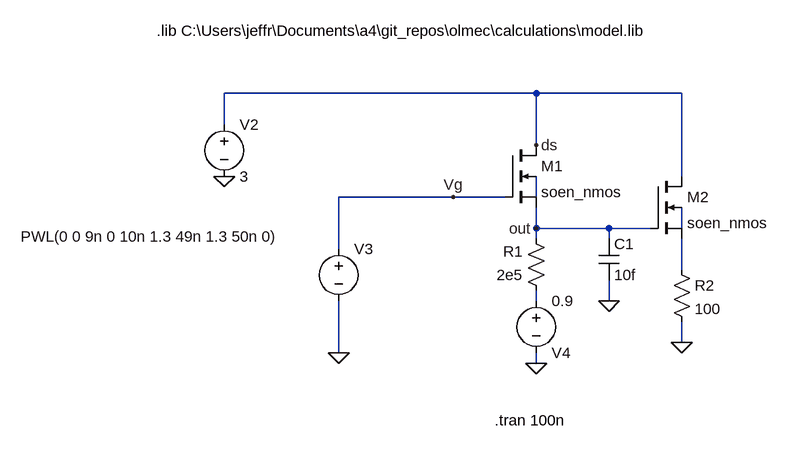
[diagram p0: schematic mosfet_rc_2mos.asc]
mosfet_rc_2mos.asc, the LTspice schematic file:
Version 4
SHEET 1 880 680
WIRE -272 144 -752 144
WIRE -48 144 -272 144
WIRE -752 192 -752 144
WIRE -272 224 -272 144
WIRE -48 272 -48 144
WIRE -400 304 -576 304
WIRE -320 304 -400 304
WIRE -272 304 -272 272
WIRE -272 352 -272 320
WIRE -160 352 -272 352
WIRE -96 352 -160 352
WIRE -48 352 -48 320
WIRE -272 368 -272 352
WIRE -160 368 -160 352
WIRE -576 384 -576 304
WIRE -48 416 -48 368
WIRE -272 464 -272 448
WIRE -160 464 -160 432
WIRE -48 528 -48 496
WIRE -576 544 -576 464
WIRE -272 560 -272 544
FLAG -752 272 0
FLAG -576 544 0
FLAG -272 224 ds
FLAG -400 304 Vg
FLAG -160 464 0
FLAG -272 352 out
FLAG -48 528 0
FLAG -272 560 0
SYMBOL voltage -752 176 R0
WINDOW 123 0 0 Left 0
WINDOW 39 0 0 Left 0
SYMATTR InstName V2
SYMATTR Value 3
SYMBOL voltage -576 368 R0
WINDOW 123 0 0 Left 0
WINDOW 39 0 0 Left 0
WINDOW 3 -489 -3 Left 2
SYMATTR Value PWL(0 0 9n 0 10n 1.3 49n 1.3 50n 0)
SYMATTR InstName V3
SYMBOL nmos4 -320 224 R0
SYMATTR InstName M1
SYMATTR Value soen_nmos
SYMATTR Value2 l=1u w=15u
SYMBOL res -256 464 R180
WINDOW 0 36 76 Left 2
WINDOW 3 36 40 Left 2
SYMATTR InstName R1
SYMATTR Value 2e5
SYMBOL nmos4 -96 272 R0
SYMATTR InstName M2
SYMATTR Value soen_nmos
SYMATTR Value2 l=1u w=10u
SYMBOL cap -176 368 R0
SYMATTR InstName C1
SYMATTR Value 10f
SYMBOL voltage -272 448 R0
WINDOW 0 24 96 Left 2
WINDOW 3 24 16 Left 2
WINDOW 123 0 0 Left 0
WINDOW 39 0 0 Left 0
SYMATTR InstName V4
SYMATTR Value 0.9
SYMBOL res -64 400 R0
SYMATTR InstName R2
SYMATTR Value 100
TEXT -336 648 Left 2 !.tran 100n
TEXT -856 48 Left 2 !.lib C:\\Users\\jeffr\\Documents\\a4\\git_repos\\olmec\\calculations\\model.lib

The netlist it stands for:
* mosfet_rc_2mos.asc
V2 ds 0 3
V3 Vg 0 PWL(0 0 9n 0 10n 1.3 49n 1.3 50n 0)
M1 ds Vg out N001 soen_nmos l=1u w=15u
R1 N004 out 2e5
M2 ds out N003 N002 soen_nmos l=1u w=10u
C1 out 0 10f
V4 N004 0 0.9
R2 N003 0 100
.model NMOS NMOS
.model PMOS PMOS
.lib standard.mos
.tran 100n
.lib C:\Users\jeffr\Documents\a4\git_repos\olmec\calculations\model.lib
.backanno
.end